# Altium project ProstheticController.PrjPcb
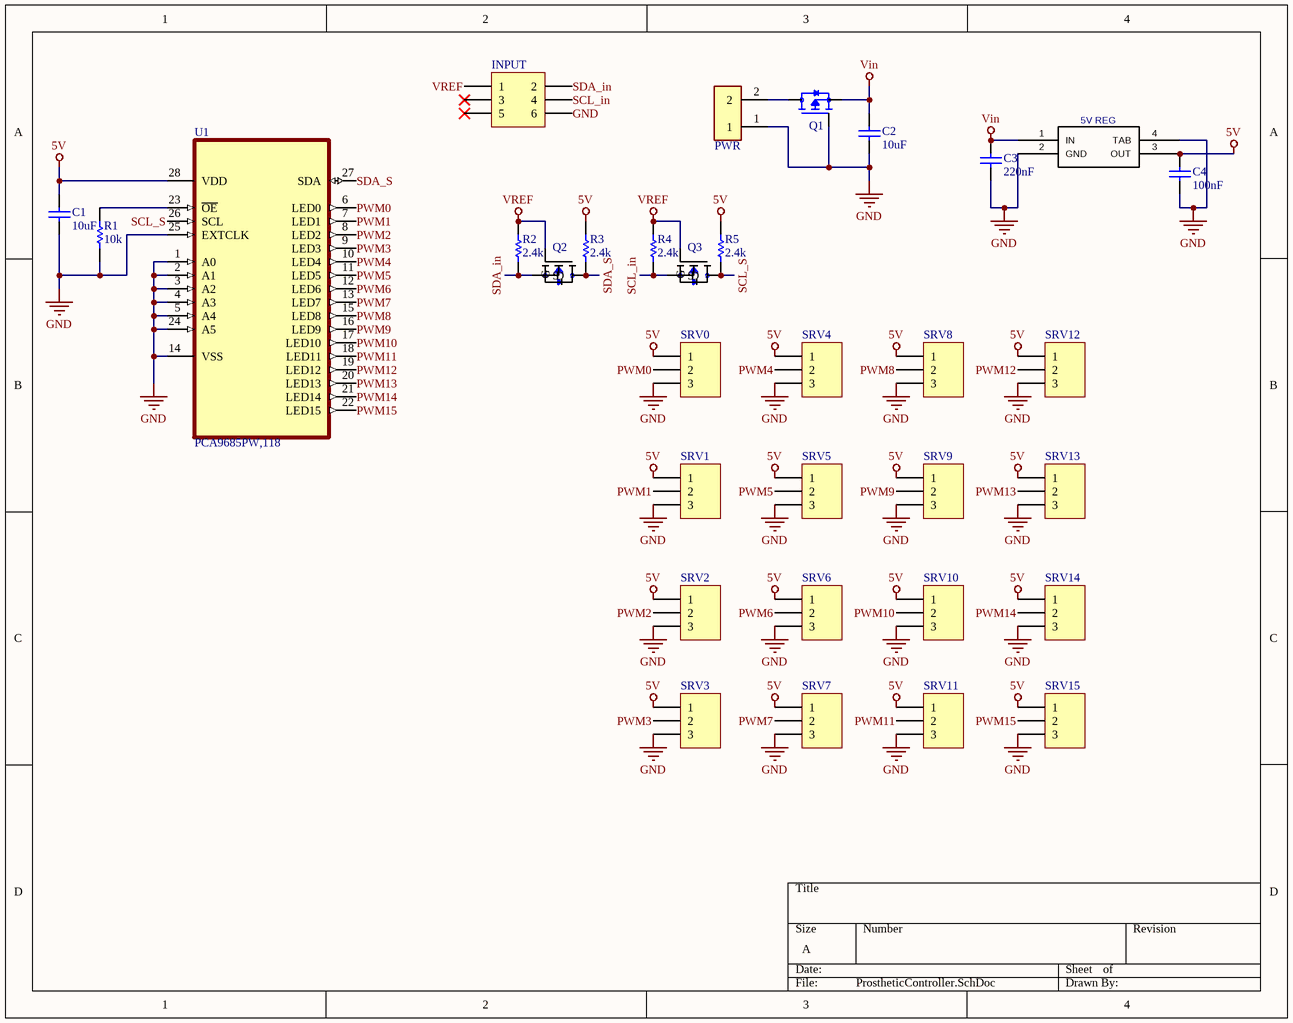
[diagram p0: ProstheticController.SchDoc]
1 sheet, 32 parts. Net scope: global (net labels, ports and power ports of the same name join across sheets).
Board file: ProstheticController.PcbDoc

## Sheet ProstheticController.SchDoc
size A

### Parts
5V_REG  LM340SX-5.0/NOPB  [TS3B_TEX]  (value not drawn)
C1  10uF  [0805-CAP]
C2  10uF  [0805-CAP]
C3  220nF  [0805-CAP]
C4  100nF  [0805-CAP]
INPUT  Header 3X2  [HDR2X3]  (value not drawn)
PWR  PWR  [OST_OSTTE020161]
Q1  AOD417  [DPAK228P994X240_3N]  (value not drawn)
Q2  BSS138  [*BSS138_BSS138(Primary)]  (value not drawn)
Q3  BSS138  [*BSS138_BSS138(Primary)]  (value not drawn)
R1  10k  [0805-RES]
R2  2.4k  [0805-RES]
R3  2.4k  [0805-RES]
R4  2.4k  [0805-RES]
R5  2.4k  [0805-RES]
SRV0  Header 3  [HDR1X3]  (value not drawn)
SRV1  Header 3  [HDR1X3]  (value not drawn)
SRV2  Header 3  [HDR1X3]  (value not drawn)
SRV3  Header 3  [HDR1X3]  (value not drawn)
SRV4  Header 3  [HDR1X3]  (value not drawn)
SRV5  Header 3  [HDR1X3]  (value not drawn)
SRV6  Header 3  [HDR1X3]  (value not drawn)
SRV7  Header 3  [HDR1X3]  (value not drawn)
SRV8  Header 3  [HDR1X3]  (value not drawn)
SRV9  Header 3  [HDR1X3]  (value not drawn)
SRV10  Header 3  [HDR1X3]  (value not drawn)
SRV11  Header 3  [HDR1X3]  (value not drawn)
SRV12  Header 3  [HDR1X3]  (value not drawn)
SRV13  Header 3  [HDR1X3]  (value not drawn)
SRV14  Header 3  [HDR1X3]  (value not drawn)
SRV15  Header 3  [HDR1X3]  (value not drawn)
U1  PCA9685PW,118  [SOP65P640X110-28N]

### Nets
5V: 5V_REG.3(OUT) C1.2 C4.2 R3.2 R5.2 SRV0.1 SRV1.1 SRV2.1 SRV3.1 SRV4.1 SRV5.1 SRV6.1 SRV7.1 SRV8.1 SRV9.1 SRV10.1 SRV11.1 SRV12.1 SRV13.1 SRV14.1 SRV15.1 U1.28(VDD)
GND: 5V_REG.2(GND) 5V_REG.4(TAB) C1.1 C2.1 C3.1 C4.1 INPUT.6 PWR.1 Q1.1(G) R1.1 SRV0.3 SRV1.3 SRV2.3 SRV3.3 SRV4.3 SRV5.3 SRV6.3 SRV7.3 SRV8.3 SRV9.3 SRV10.3 SRV11.3 SRV12.3 SRV13.3 SRV14.3 SRV15.3 U1.1(A0) U1.2(A1) U1.3(A2) U1.4(A3) U1.5(A4) U1.14(VSS) U1.24(A5) U1.25(EXTCLK)
Vin: 5V_REG.1(IN) C2.2 C3.2 Q1.3(S)
VREF: INPUT.1 Q2.G Q3.G R2.2 R4.2
PWM0: SRV0.2 U1.6(LED0)
PWM1: SRV1.2 U1.7(LED1)
PWM2: SRV2.2 U1.8(LED2)
PWM3: SRV3.2 U1.9(LED3)
PWM4: SRV4.2 U1.10(LED4)
PWM5: SRV5.2 U1.11(LED5)
PWM6: SRV6.2 U1.12(LED6)
PWM7: SRV7.2 U1.13(LED7)
PWM8: SRV8.2 U1.15(LED8)
PWM9: SRV9.2 U1.16(LED9)
PWM10: SRV10.2 U1.17(LED10)
PWM11: SRV11.2 U1.18(LED11)
PWM12: SRV12.2 U1.19(LED12)
PWM13: SRV13.2 U1.20(LED13)
PWM14: SRV14.2 U1.21(LED14)
PWM15: SRV15.2 U1.22(LED15)
SCL_in: INPUT.4 Q3.S R4.1
SCL_S: Q3.D R5.1 U1.26(SCL)
SDA_in: INPUT.2 Q2.S R2.1
SDA_S: Q2.D R3.1 U1.27(SDA)
NetPWR_2: PWR.2 Q1.4(D)
NetR1_2: R1.2 U1.23(~{OE})

Not connected (* = marked no-connect by the designer): INPUT 3* 5*

### Library data of the parts
5V_REG = LM340SX-5.0/NOPB: C: Copyright (C) 2015 Accelerated Designs. All rights reserved; Vendor: Texas Instruments; Built_By: EMA_UL_Team; SourceLibrary: National_2014-06-20; Value: LM340SX-5.0/NOPB; Manufacturer_Part_Number: LM340SX-5.0/NOPB
C1-C4 = Cap: Capacitor
INPUT = Header 3X2: Header, 3-Pin, Dual row; LatestRevisionDate: 17-Jul-2002; LatestRevisionNote: Re-released for DXP Platform.; Publisher: Altium Limited
PWR = OSTTE020161: Fio de 2 posiÃ§Ãµes para embarcar na horizontal do bloco de terminais com furo passante da placa 0,138 _3,50 mm_; MF: On Shore; Value: *; MP: OSTTE020161; SnapEDA_Link: https://www.snapeda.com/parts/OSTTE020161/On%20Shore%20Technology%20Inc./view-part/249314/?ref=snap; Availability: Unavailable; Package: None; Price: None
Q1 = AOD417: P-Channel 30V 25A _Ta_ 2.5W _Ta_, 50W _Tc_ Surface Mount TO-252, _D-Pak_; MF: Alpha &; SnapEDA_Link: https://www.snapeda.com/parts/AOD417/Alpha%20%26%20Omega%20Semiconductor%20Inc./view-part/454934/?ref=snap; Availability: Unavailable; MP: AOD417; Price: None; Package: TO-252 Alpha &amp; Omega Semiconductor; Value: *
Q2 Q3 = BSS138: N-Channel 50V 220mA _Ta_ 360mW _Ta_ Surface Mount Die; MF: MICROSS/On Semiconductor; SnapEDA_Link: https://www.snapeda.com/parts/BSS138/MICROSS/On%20Semiconductor/view-part/215/?ref=snap; Price: None; Availability: Unavailable; MP: BSS138; Package: SOT-23 Fairchild Semiconductor; Value: *
R1-R5 = ResBasic: Resistor
SRV0-SRV15 = Header 3: Header, 3-Pin; LatestRevisionDate: 17-Jul-2002; LatestRevisionNote: Re-released for DXP Platform.; Publisher: Altium Limited
U1 = PCA9685PW,118: LED Driver IC 16 Output Linear PWM Dimming 25mA 28-TSSOP; MF: NXP USA; Package: TSSOP-28 NXP Semiconductors; MP: PCA9685PW,118; Value: *; SnapEDA_Link: https://www.snapeda.com/parts/PCA9685PW%2C118/NXP%20USA%20Inc./view-part/1041520/?ref=snap; Digi-Key_Purchase_URL: https://www.digikey.in/product-detail/en/nxp-usa-inc/PCA9685PW,118/568-11925-1-ND/5221902?utm_source=snapeda&utm_medium=aggregator&utm_campaign=symbol; Digi-Key_Part_Number: 568-11925-1-ND